# Altium schematic sheet STM32_FYP_Digital_In_Module.SchDoc
size A4; Organization: Altium Limited; Address1: L3, 12a Rodborough Rd; Address2: Frenchs Forest; Address3: NSW; Address4: Australia 2086
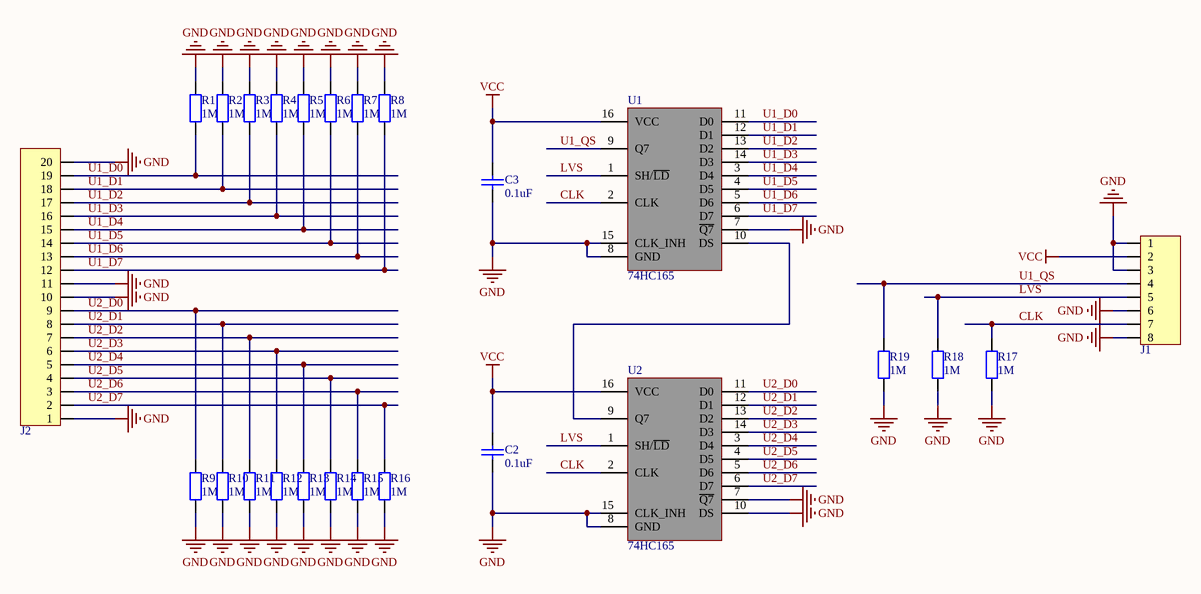
[diagram p0: STM32_FYP_Digital_In_Module.SchDoc]

## Parts
C2  0.1uF  [0805C_M]
C3  0.1uF  [0805C_M]
J1  Header8  [8P-2.54-H]  (value not drawn)
J2  Header20  [20P-2.54-H]  (value not drawn)
R1  1M  [0805R_M]
R2  1M  [0805R_M]
R3  1M  [0805R_M]
R4  1M  [0805R_M]
R5  1M  [0805R_M]
R6  1M  [0805R_M]
R7  1M  [0805R_M]
R8  1M  [0805R_M]
R9  1M  [0805R_M]
R10  1M  [0805R_M]
R11  1M  [0805R_M]
R12  1M  [0805R_M]
R13  1M  [0805R_M]
R14  1M  [0805R_M]
R15  1M  [0805R_M]
R16  1M  [0805R_M]
R17  1M  [0805R_M]
R18  1M  [0805R_M]
R19  1M  [0805R_M]
U1  74HC165  [SOIC-16_150mil]
U2  74HC165  [SOIC-16_150mil]

## Nets
GND: C2.2 C3.2 J1.1 J1.3 J1.6 J1.8 J2.1 J2.10 J2.11 J2.20 R1.2 R2.2 R3.2 R4.2 R5.2 R6.2 R7.2 R8.2 R9.1 R10.1 R11.1 R12.1 R13.1 R14.1 R15.1 R16.1 R17.1 R18.1 R19.1 U1.7(~{Q7}) U1.8(GND) U1.15(CLK_INH) U2.7(~{Q7}) U2.8(GND) U2.10(DS) U2.15(CLK_INH)
VCC: C2.1 C3.1 J1.2 U1.16(VCC) U2.16(VCC)
CLK: J1.7 R17.2 U1.2(CLK) U2.2(CLK)
LVS: J1.5 R18.2 U1.1(SH/~{LD}) U2.1(SH/~{LD})
U1_D0: J2.19 R1.1 U1.11(D0)
U1_D1: J2.18 R2.1 U1.12(D1)
U1_D2: J2.17 R3.1 U1.13(D2)
U1_D3: J2.16 R4.1 U1.14(D3)
U1_D4: J2.15 R5.1 U1.3(D4)
U1_D5: J2.14 R6.1 U1.4(D5)
U1_D6: J2.13 R7.1 U1.5(D6)
U1_D7: J2.12 R8.1 U1.6(D7)
U1_QS: J1.4 R19.2 U1.9(Q7)
U2_D0: J2.9 R9.2 U2.11(D0)
U2_D1: J2.8 R10.2 U2.12(D1)
U2_D2: J2.7 R11.2 U2.13(D2)
U2_D3: J2.6 R12.2 U2.14(D3)
U2_D4: J2.5 R13.2 U2.3(D4)
U2_D5: J2.4 R14.2 U2.4(D5)
U2_D6: J2.3 R15.2 U2.5(D6)
U2_D7: J2.2 R16.2 U2.6(D7)
NetU1_10: U1.10(DS) U2.9(Q7)

## Notes on the sheet
- Title
- Size:
- Date:
- A4
- Number:
- Time:
- Revision:
- Sheet
- of
- File:

## Library data of the parts
C2 C3 = Cap: 无极性电容; Published: 8-Jun-2000; LatestRevisionDate: 17-Jul-2002; LatestRevisionNote: Re-released for DXP Platform.; PackageReference: RAD-0.3; Publisher: Altium Limited; PackageDescription: Radial Cap, Thru-Hole; 2 Leads; 0.3 in Pin Spacing; Value: 0.1uF
J1 = Header8: 8PIN插座
J2 = Header20: 20PIN插座
R1-R19 = Res: 电阻; Published: 8-Jun-2000; LatestRevisionDate: 17-Jul-2002; LatestRevisionNote: Re-released for DXP Platform.; PackageReference: AXIAL-0.4; Publisher: Altium Limited; PackageDescription: Axial Device, Thru-Hole; 2 Leads; 0.4 in Pin Spacing
U1 U2 = 74HC165: 并入串出移位寄存器